# EAGLE design motherboard (EAGLE 9.0.0)

## Sheet 1 of 6: Power
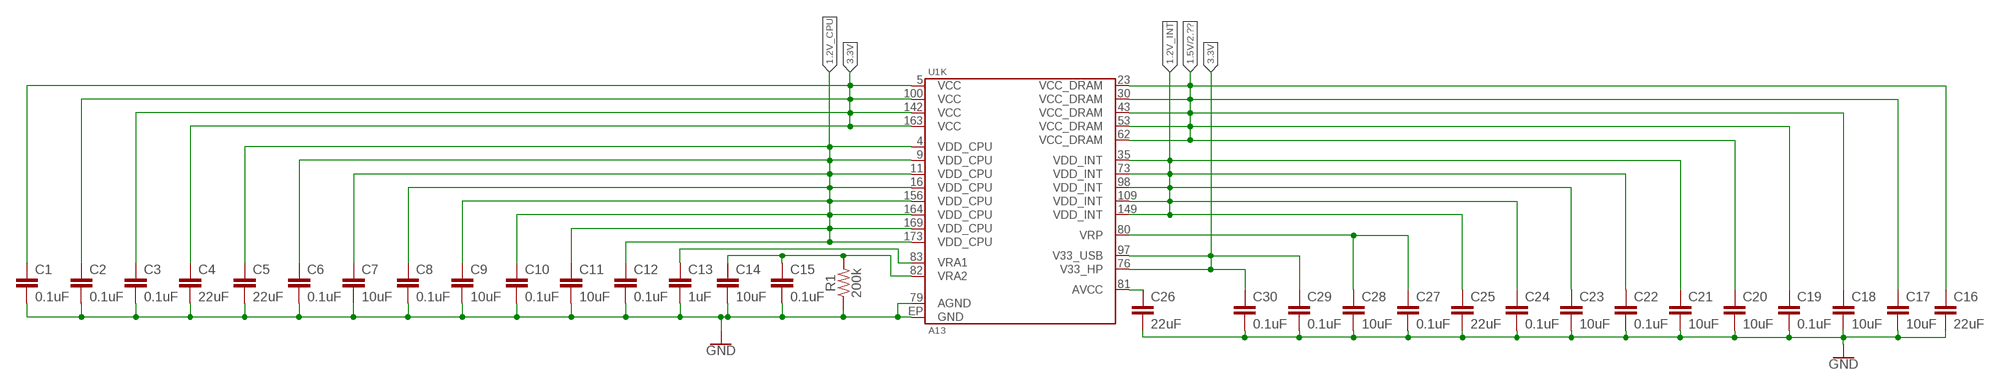
[diagram p0: schematic, sheet 1]

### Parts
C1  0.1uF  0.1UF-0603-25V-(+80/-20%)  [0603]
C2  0.1uF  0.1UF-0603-25V-(+80/-20%)  [0603]
C3  0.1uF  0.1UF-0603-25V-(+80/-20%)  [0603]
C4  22uF  0.1UF-0603-25V-(+80/-20%)  [0603]
C5  22uF  0.1UF-0603-25V-(+80/-20%)  [0603]
C6  0.1uF  0.1UF-0603-25V-(+80/-20%)  [0603]
C7  10uF  0.1UF-0603-25V-(+80/-20%)  [0603]
C8  0.1uF  0.1UF-0603-25V-(+80/-20%)  [0603]
C9  10uF  0.1UF-0603-25V-(+80/-20%)  [0603]
C10  0.1uF  0.1UF-0603-25V-(+80/-20%)  [0603]
C11  10uF  0.1UF-0603-25V-(+80/-20%)  [0603]
C12  0.1uF  0.1UF-0603-25V-(+80/-20%)  [0603]
C13  1uF  0.1UF-0603-25V-(+80/-20%)  [0603]
C14  10uF  0.1UF-0603-25V-(+80/-20%)  [0603]
C15  0.1uF  0.1UF-0603-25V-(+80/-20%)  [0603]
C16  22uF  0.1UF-0603-25V-(+80/-20%)  [0603]
C17  10uF  0.1UF-0603-25V-(+80/-20%)  [0603]
C18  10uF  0.1UF-0603-25V-(+80/-20%)  [0603]
C19  0.1uF  0.1UF-0603-25V-(+80/-20%)  [0603]
C20  10uF  0.1UF-0603-25V-(+80/-20%)  [0603]
C21  10uF  0.1UF-0603-25V-(+80/-20%)  [0603]
C22  0.1uF  0.1UF-0603-25V-(+80/-20%)  [0603]
C23  10uF  0.1UF-0603-25V-(+80/-20%)  [0603]
C24  0.1uF  0.1UF-0603-25V-(+80/-20%)  [0603]
C25  22uF  0.1UF-0603-25V-(+80/-20%)  [0603]
C26  22uF  0.1UF-0603-25V-(+80/-20%)  [0603]
C27  0.1uF  0.1UF-0603-25V-(+80/-20%)  [0603]
C28  10uF  0.1UF-0603-25V-(+80/-20%)  [0603]
C29  0.1uF  0.1UF-0603-25V-(+80/-20%)  [0603]
C30  0.1uF  0.1UF-0603-25V-(+80/-20%)  [0603]
R1  200k  200KOHM-0603-1/10W-1%  [0603]
U1  A13  [A13]

### Nets
1.2V_CPU: C5.1 C6.1 C7.1 C8.1 C9.1 C10.1 C11.1 C12.1 U1.4(K:VDD_CPU) U1.9(K:VDD_CPU) U1.11(K:VDD_CPU) U1.16(K:VDD_CPU) U1.156(K:VDD_CPU) U1.164(K:VDD_CPU) U1.169(K:VDD_CPU) U1.173(K:VDD_CPU)
1.2V_INT: C21.1 C22.1 C23.1 C24.1 C25.1 U1.35(K:VDD_INT) U1.73(K:VDD_INT) U1.98(K:VDD_INT) U1.109(K:VDD_INT) U1.149(K:VDD_INT)
1.5V: C16.1 C17.1 C18.1 C19.1 C20.1 U1.23(K:VCC_DRAM) U1.30(K:VCC_DRAM) U1.43(K:VCC_DRAM) U1.53(K:VCC_DRAM) U1.62(K:VCC_DRAM) ; also sheet 2
3.3V: C1.1 C2.1 C3.1 C4.1 C29.1 C30.1 U1.5(K:VCC) U1.76(K:V33_HP) U1.97(K:V33_USB) U1.100(K:VCC) U1.142(K:VCC) U1.163(K:VCC)
GND: C1.2 C2.2 C3.2 C4.2 C5.2 C6.2 C7.2 C8.2 C9.2 C10.2 C11.2 C12.2 C13.2 C14.2 C15.2 C16.2 C17.2 C18.2 C19.2 C20.2 C21.2 C22.2 C23.2 C24.2 C25.2 C26.2 C27.2 C28.2 C29.2 C30.2 R1.1 U1.79(K:AGND) U1.EP(K:GND) ; also sheet 2,6
N$12: C13.1 U1.83(K:VRA1)
N$13: C14.1 C15.1 R1.2 U1.82(K:VRA2)
N$24: C26.1 U1.81(K:AVCC)
N$25: C27.1 C28.1 U1.80(K:VRP)
Unconnected: U1.74(B:HPOUTL) U1.75(B:HPBP) U1.77(B:HPCOM) U1.78(B:HPOUTR) U1.84(B:MIC_IN1) U1.85(B:V_MIC) U1.126(H:LCD_VSYNC) U1.127(H:LCD_HSYNC) U1.128(H:LCD_DE) U1.129(H:LCD_CLK) U1.130(H:LCD_D23) U1.131(H:LCD_D22) U1.132(H:LCD_D21) U1.133(H:LCD_D20) U1.134(H:LCD_D19) U1.135(H:LCD_D18) U1.136(H:LCD_D15) U1.137(H:LCD_D14) U1.138(H:LCD_D13) U1.139(H:LCD_D12) U1.140(H:LCD_D11) U1.141(H:LCD_D10) U1.143(H:LCD_D7) U1.144(H:LCD_D6) U1.145(H:LCD_D5) U1.146(H:LCD_D4) U1.147(H:LCD_D3) U1.148(H:LCD_D2)

## Sheet 2 of 6: DRAM
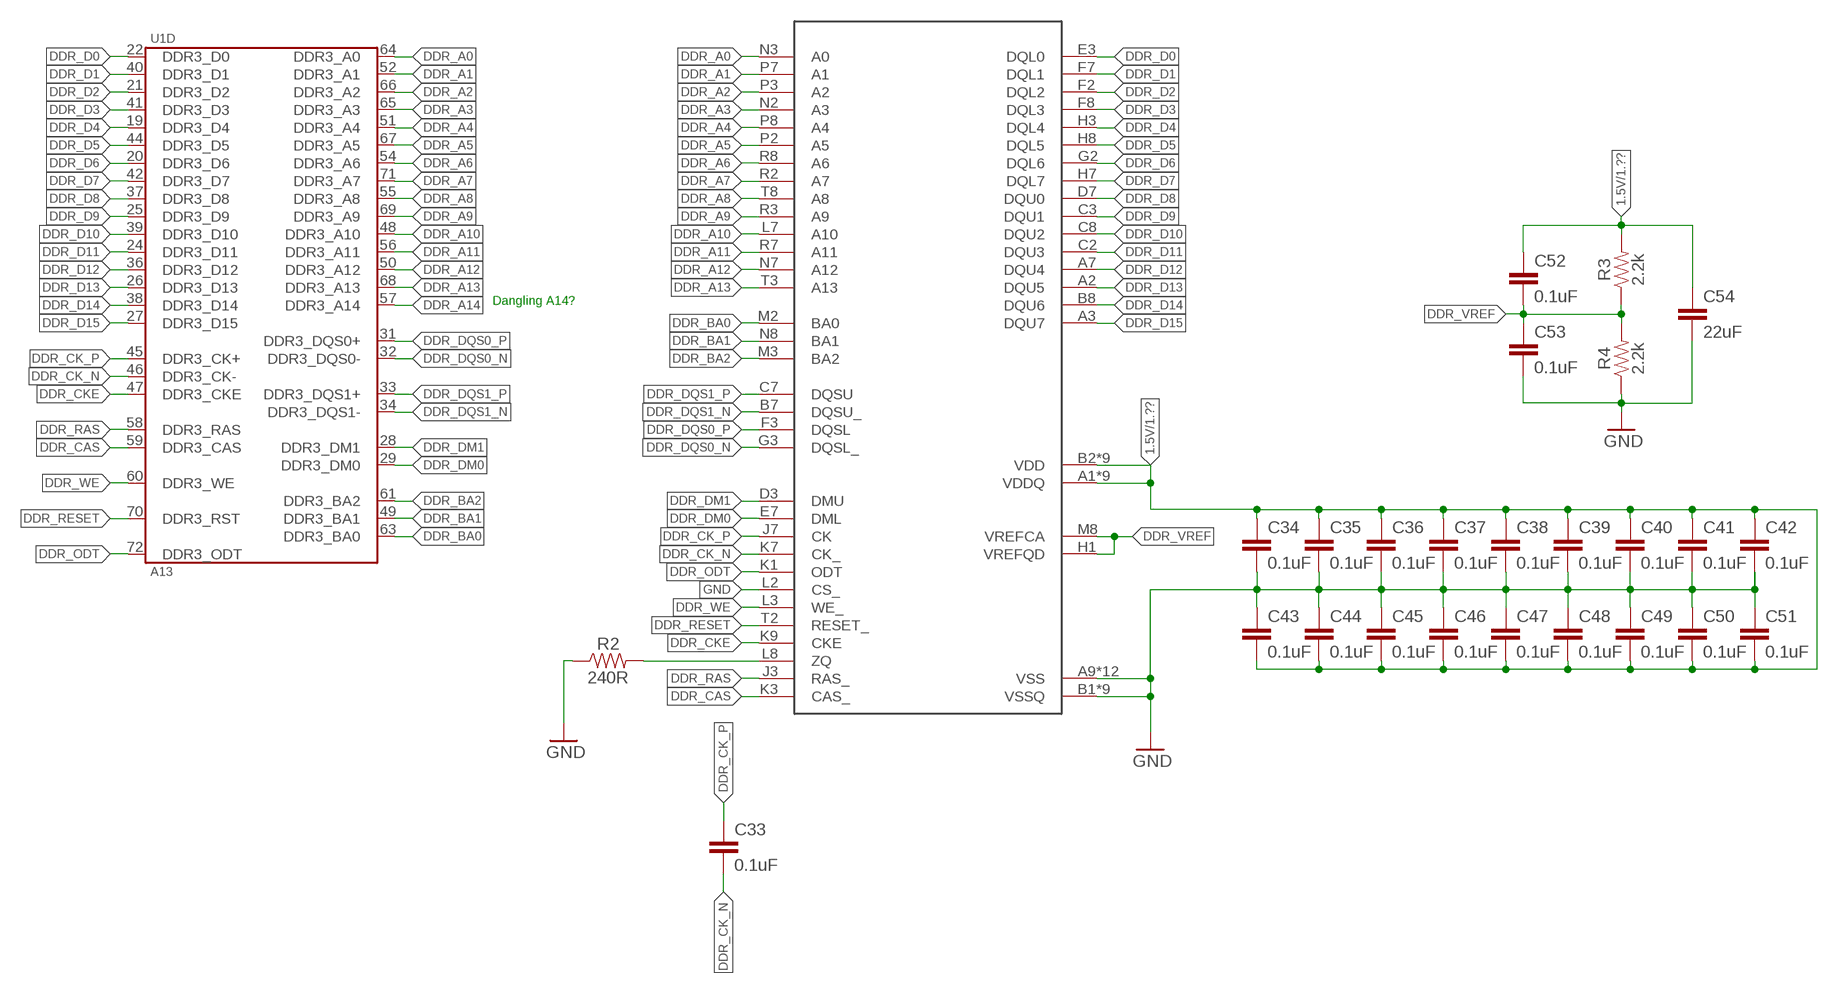
[diagram p1: schematic, sheet 2]

### Parts
C33  0.1uF  0.1UF-0603-25V-(+80/-20%)  [0603]
C34  0.1uF  0.1UF-0603-25V-(+80/-20%)  [0603]
C35  0.1uF  0.1UF-0603-25V-(+80/-20%)  [0603]
C36  0.1uF  0.1UF-0603-25V-(+80/-20%)  [0603]
C37  0.1uF  0.1UF-0603-25V-(+80/-20%)  [0603]
C38  0.1uF  0.1UF-0603-25V-(+80/-20%)  [0603]
C39  0.1uF  0.1UF-0603-25V-(+80/-20%)  [0603]
C40  0.1uF  0.1UF-0603-25V-(+80/-20%)  [0603]
C41  0.1uF  0.1UF-0603-25V-(+80/-20%)  [0603]
C42  0.1uF  0.1UF-0603-25V-(+80/-20%)  [0603]
C43  0.1uF  0.1UF-0603-25V-(+80/-20%)  [0603]
C44  0.1uF  0.1UF-0603-25V-(+80/-20%)  [0603]
C45  0.1uF  0.1UF-0603-25V-(+80/-20%)  [0603]
C46  0.1uF  0.1UF-0603-25V-(+80/-20%)  [0603]
C47  0.1uF  0.1UF-0603-25V-(+80/-20%)  [0603]
C48  0.1uF  0.1UF-0603-25V-(+80/-20%)  [0603]
C49  0.1uF  0.1UF-0603-25V-(+80/-20%)  [0603]
C50  0.1uF  0.1UF-0603-25V-(+80/-20%)  [0603]
C51  0.1uF  0.1UF-0603-25V-(+80/-20%)  [0603]
C52  0.1uF  0.1UF-0603-25V-(+80/-20%)  [0603]
C53  0.1uF  0.1UF-0603-25V-(+80/-20%)  [0603]
C54  22uF  0.1UF-0603-25V-(+80/-20%)  [0603]
DRAM  AS4C128M16D3B-12BCN  [FBGA96-6X16]
R2  240R  200KOHM-0603-1/10W-1%  [0603]
R3  2.2k  200KOHM-0603-1/10W-1%  [0603]
R4  2.2k  200KOHM-0603-1/10W-1%  [0603]

### Nets
1.5V: C34.1 C35.1 C36.1 C37.1 C38.1 C39.1 C40.1 C41.1 C42.1 C43.2 C44.2 C45.2 C46.2 C47.2 C48.2 C49.2 C50.2 C51.2 C52.1 C54.1 DRAM.A1(VDDQ) DRAM.A8(VDDQ) DRAM.B2(VDD) DRAM.C1(VDDQ) DRAM.C9(VDDQ) DRAM.D2(VDDQ) DRAM.D9(VDD) DRAM.E9(VDDQ) DRAM.F1(VDDQ) DRAM.G7(VDD) DRAM.H2(VDDQ) DRAM.H9(VDDQ) DRAM.K2(VDD) DRAM.K8(VDD) DRAM.N1(VDD) DRAM.N9(VDD) DRAM.R1(VDD) DRAM.R9(VDD) R3.2 ; also sheet 1
DDR_A0: DRAM.N3(A0) U1.64(D:DDR3_A0)
DDR_A1: DRAM.P7(A1) U1.52(D:DDR3_A1)
DDR_A2: DRAM.P3(A2) U1.66(D:DDR3_A2)
DDR_A3: DRAM.N2(A3) U1.65(D:DDR3_A3)
DDR_A4: DRAM.P8(A4) U1.51(D:DDR3_A4)
DDR_A5: DRAM.P2(A5) U1.67(D:DDR3_A5)
DDR_A6: DRAM.R8(A6) U1.54(D:DDR3_A6)
DDR_A7: DRAM.R2(A7) U1.71(D:DDR3_A7)
DDR_A8: DRAM.T8(A8) U1.55(D:DDR3_A8)
DDR_A9: DRAM.R3(A9) U1.69(D:DDR3_A9)
DDR_A10: DRAM.L7(A10) U1.48(D:DDR3_A10)
DDR_A11: DRAM.R7(A11) U1.56(D:DDR3_A11)
DDR_A12: DRAM.N7(A12) U1.50(D:DDR3_A12)
DDR_A13: DRAM.T3(A13) U1.68(D:DDR3_A13)
DDR_A14: U1.57(D:DDR3_A14)
DDR_BA0: DRAM.M2(BA0) U1.63(D:DDR3_BA0)
DDR_BA1: DRAM.N8(BA1) U1.49(D:DDR3_BA1)
DDR_BA2: DRAM.M3(BA2) U1.61(D:DDR3_BA2)
DDR_CAS: DRAM.K3(CAS_) U1.59(D:DDR3_CAS)
DDR_CK_N: C33.2 DRAM.K7(CK_) U1.46(D:DDR3_CK-)
DDR_CK_P: C33.1 DRAM.J7(CK) U1.45(D:DDR3_CK+)
DDR_CKE: DRAM.K9(CKE) U1.47(D:DDR3_CKE)
DDR_D0: DRAM.E3(DQL0) U1.22(D:DDR3_D0)
DDR_D1: DRAM.F7(DQL1) U1.40(D:DDR3_D1)
DDR_D2: DRAM.F2(DQL2) U1.21(D:DDR3_D2)
DDR_D3: DRAM.F8(DQL3) U1.41(D:DDR3_D3)
DDR_D4: DRAM.H3(DQL4) U1.19(D:DDR3_D4)
DDR_D5: DRAM.H8(DQL5) U1.44(D:DDR3_D5)
DDR_D6: DRAM.G2(DQL6) U1.20(D:DDR3_D6)
DDR_D7: DRAM.H7(DQL7) U1.42(D:DDR3_D7)
DDR_D8: DRAM.D7(DQU0) U1.37(D:DDR3_D8)
DDR_D9: DRAM.C3(DQU1) U1.25(D:DDR3_D9)
DDR_D10: DRAM.C8(DQU2) U1.39(D:DDR3_D10)
DDR_D11: DRAM.C2(DQU3) U1.24(D:DDR3_D11)
DDR_D12: DRAM.A7(DQU4) U1.36(D:DDR3_D12)
DDR_D13: DRAM.A2(DQU5) U1.26(D:DDR3_D13)
DDR_D14: DRAM.B8(DQU6) U1.38(D:DDR3_D14)
DDR_D15: DRAM.A3(DQU7) U1.27(D:DDR3_D15)
DDR_DM0: DRAM.E7(DML) U1.29(D:DDR3_DM0)
DDR_DM1: DRAM.D3(DMU) U1.28(D:DDR3_DM1)
DDR_DQS0_N: DRAM.G3(DQSL_) U1.32(D:DDR3_DQS0-)
DDR_DQS0_P: DRAM.F3(DQSL) U1.31(D:DDR3_DQS0+)
DDR_DQS1_N: DRAM.B7(DQSU_) U1.34(D:DDR3_DQS1-)
DDR_DQS1_P: DRAM.C7(DQSU) U1.33(D:DDR3_DQS1+)
DDR_ODT: DRAM.K1(ODT) U1.72(D:DDR3_ODT)
DDR_RAS: DRAM.J3(RAS_) U1.58(D:DDR3_RAS)
DDR_RESET: DRAM.T2(RESET_) U1.70(D:DDR3_RST)
DDR_VREF: C52.2 C53.1 DRAM.H1(VREFQD) DRAM.M8(VREFCA) R3.1 R4.2
DDR_WE: DRAM.L3(WE_) U1.60(D:DDR3_WE)
GND: C34.2 C35.2 C36.2 C37.2 C38.2 C39.2 C40.2 C41.2 C42.2 C43.1 C44.1 C45.1 C46.1 C47.1 C48.1 C49.1 C50.1 C51.1 C53.2 C54.2 DRAM.A9(VSS) DRAM.B1(VSSQ) DRAM.B3(VSS) DRAM.B9(VSSQ) DRAM.D1(VSSQ) DRAM.D8(VSSQ) DRAM.E1(VSS) DRAM.E2(VSSQ) DRAM.E8(VSSQ) DRAM.F9(VSSQ) DRAM.G1(VSSQ) DRAM.G8(VSS) DRAM.G9(VSSQ) DRAM.J2(VSS) DRAM.J8(VSS) DRAM.L2(CS_) DRAM.M1(VSS) DRAM.M9(VSS) DRAM.P1(VSS) DRAM.P9(VSS) DRAM.T1(VSS) DRAM.T9(VSS) R2.1 R4.1 ; also sheet 1,6
ZQ: DRAM.L8(ZQ) R2.2

### Notes on the sheet
- Dangling A14?

## Sheet 3 of 6: IO

## Sheet 4 of 6: Storage

## Sheet 5 of 6: Other parts
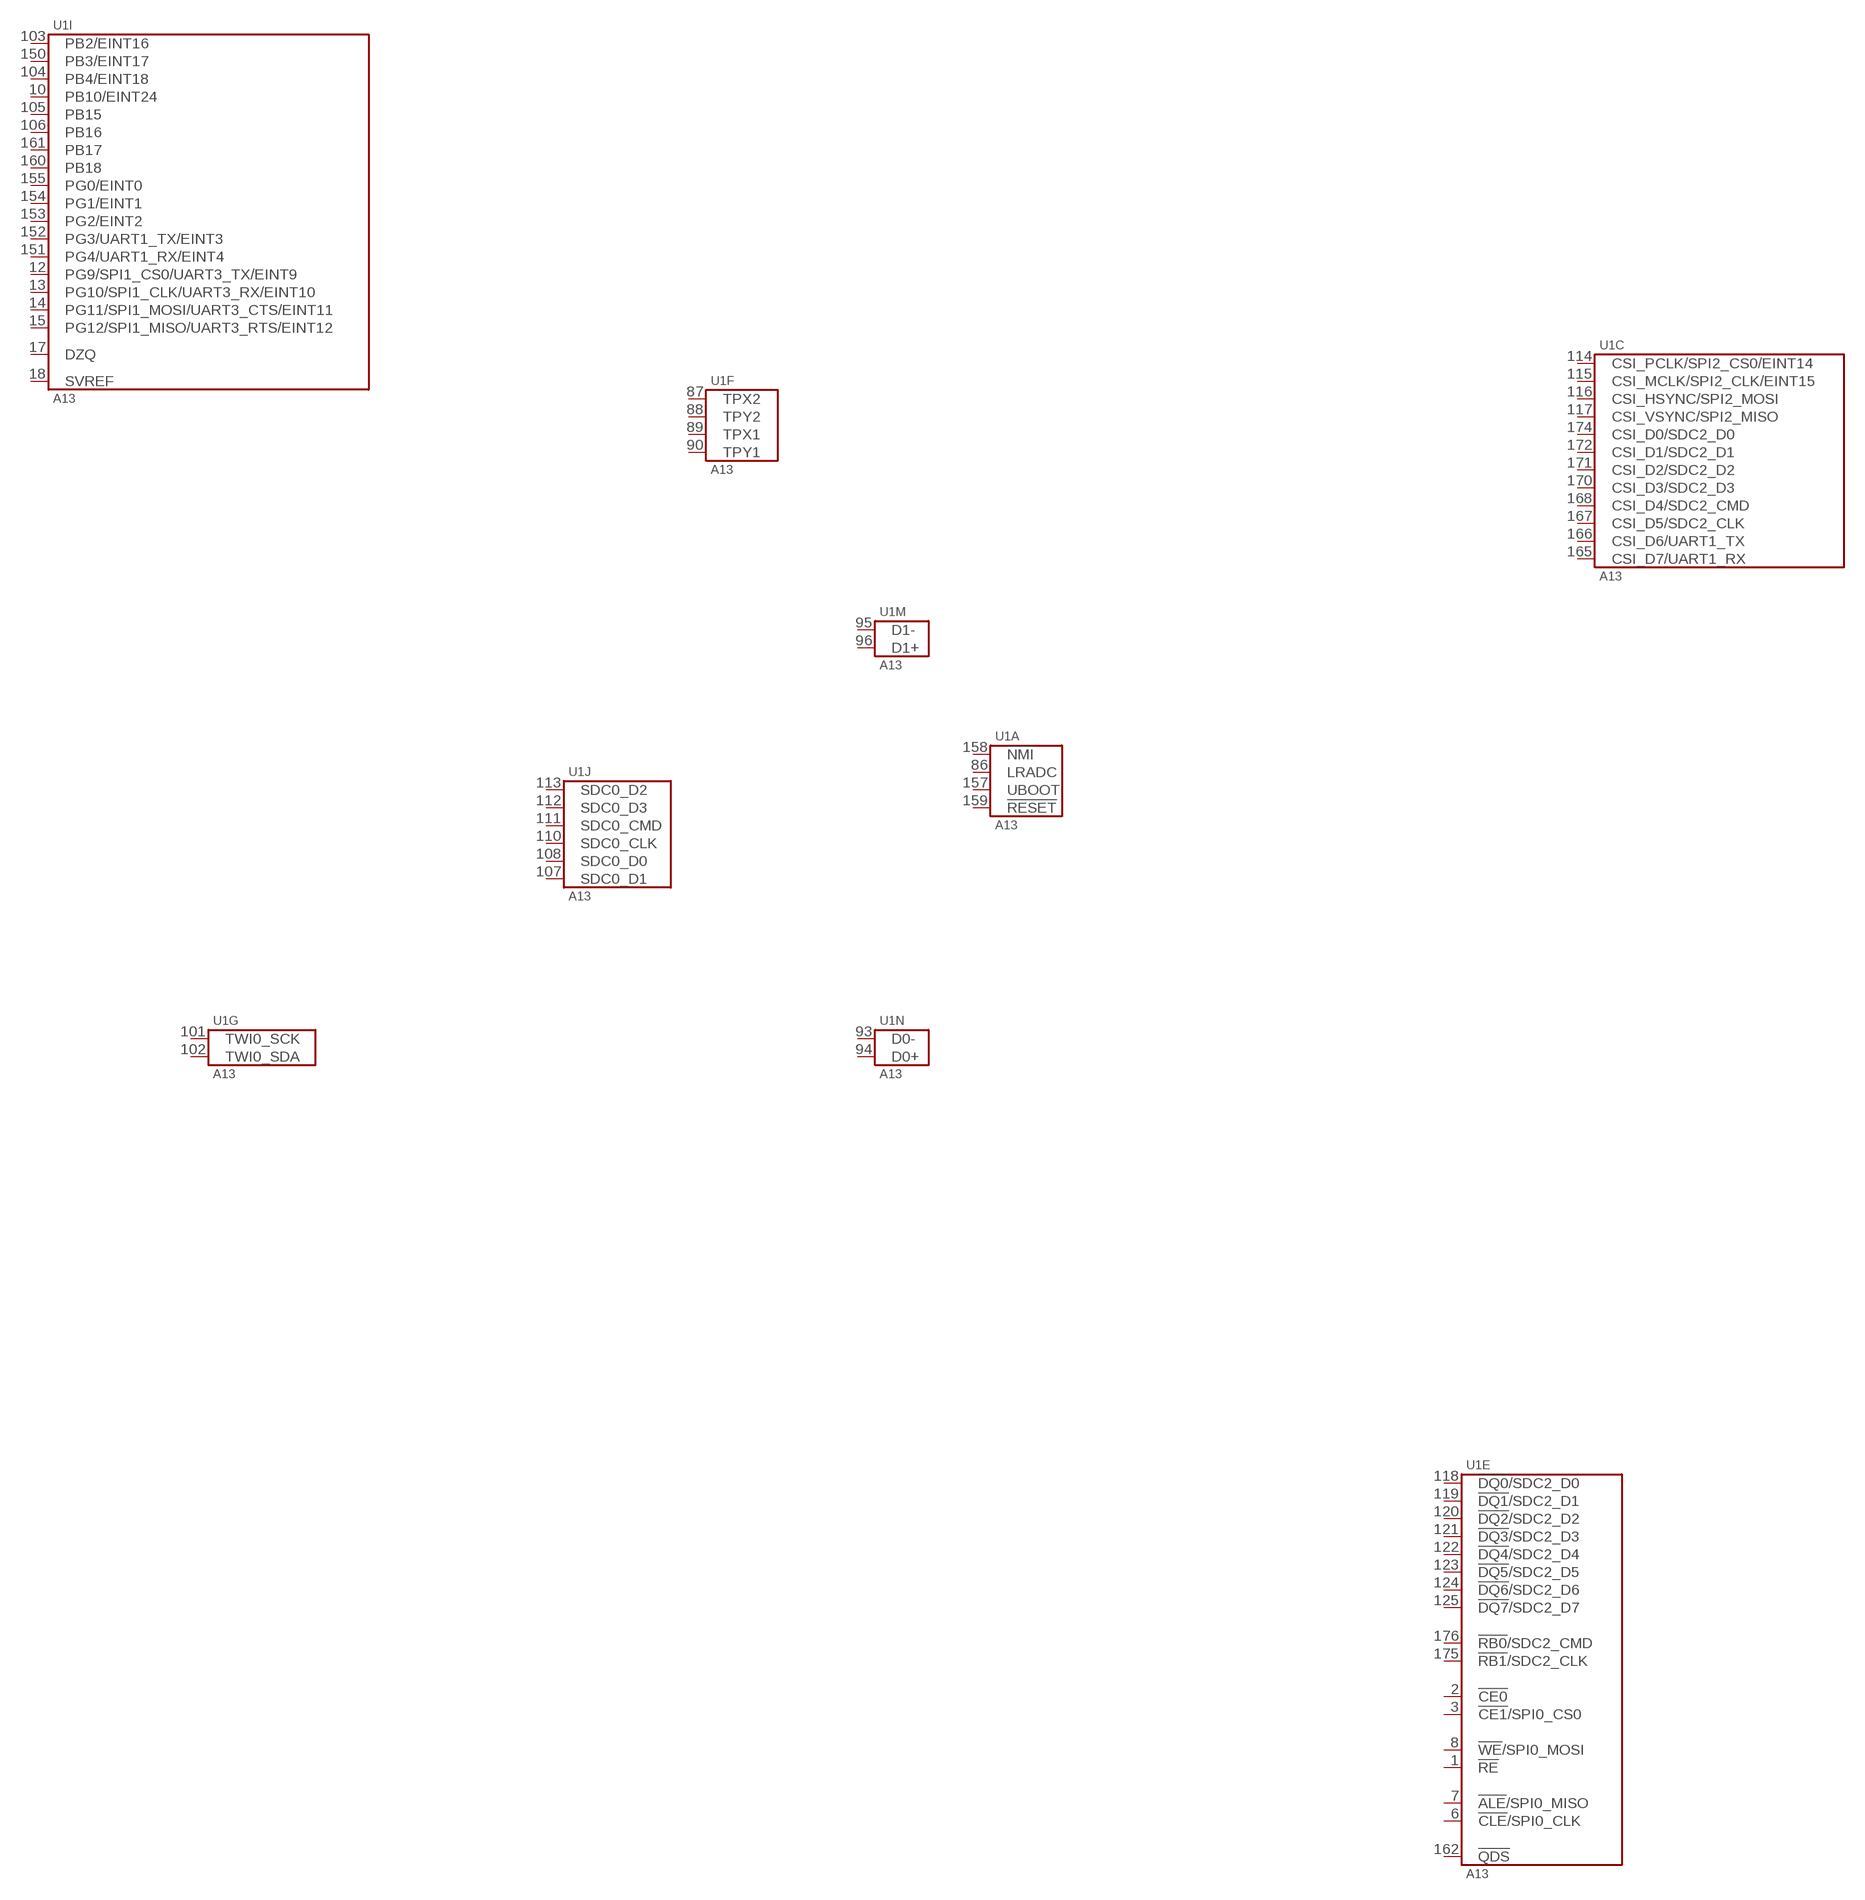
[diagram p2: schematic, sheet 5]
Unconnected: U1.1(E:!RE) U1.2(E:!CE0) U1.3(E:!CE1!/SPI0_CS0) U1.6(E:!CLE!/SPI0_CLK) U1.7(E:!ALE!/SPI0_MISO) U1.8(E:!WE!/SPI0_MOSI) U1.10(I:PB10/EINT24) U1.12(I:PG9/SPI1_CS0/UART3_TX/EINT9) U1.13(I:PG10/SPI1_CLK/UART3_RX/EINT10) U1.14(I:PG11/SPI1_MOSI/UART3_CTS/EINT11) U1.15(I:PG12/SPI1_MISO/UART3_RTS/EINT12) U1.17(I:DZQ) U1.18(I:SVREF) U1.86(A:LRADC) U1.87(F:TPX2) U1.88(F:TPY2) U1.89(F:TPX1) U1.90(F:TPY1) U1.93(N:D0-) U1.94(N:D0+) U1.95(M:D1-) U1.96(M:D1+) U1.101(G:TWI0_SCK) U1.102(G:TWI0_SDA) U1.103(I:PB2/EINT16) U1.104(I:PB4/EINT18) U1.105(I:PB15) U1.106(I:PB16) U1.107(J:SDC0_D1) U1.108(J:SDC0_D0) U1.110(J:SDC0_CLK) U1.111(J:SDC0_CMD) U1.112(J:SDC0_D3) U1.113(J:SDC0_D2) U1.114(C:CSI_PCLK/SPI2_CS0/EINT14) U1.115(C:CSI_MCLK/SPI2_CLK/EINT15) U1.116(C:CSI_HSYNC/SPI2_MOSI) U1.117(C:CSI_VSYNC/SPI2_MISO) U1.118(E:!DQ0!/SDC2_D0) U1.119(E:!DQ1!/SDC2_D1) U1.120(E:!DQ2!/SDC2_D2) U1.121(E:!DQ3!/SDC2_D3) U1.122(E:!DQ4!/SDC2_D4) U1.123(E:!DQ5!/SDC2_D5) U1.124(E:!DQ6!/SDC2_D6) U1.125(E:!DQ7!/SDC2_D7) U1.150(I:PB3/EINT17) U1.151(I:PG4/UART1_RX/EINT4) U1.152(I:PG3/UART1_TX/EINT3) U1.153(I:PG2/EINT2) U1.154(I:PG1/EINT1) U1.155(I:PG0/EINT0) U1.157(A:UBOOT) U1.158(A:!NMI) U1.159(A:!RESET) U1.160(I:PB18) U1.161(I:PB17) U1.162(E:!QDS) U1.165(C:CSI_D7/UART1_RX) U1.166(C:CSI_D6/UART1_TX) U1.167(C:CSI_D5/SDC2_CLK) U1.168(C:CSI_D4/SDC2_CMD) U1.170(C:CSI_D3/SDC2_D3) U1.171(C:CSI_D2/SDC2_D2) U1.172(C:CSI_D1/SDC2_D1) U1.174(C:CSI_D0/SDC2_D0) U1.175(E:!RB1!/SDC2_CLK) U1.176(E:!RB0!/SDC2_CMD)

## Sheet 6 of 6: Timing
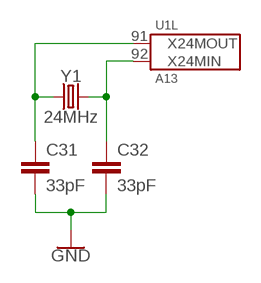
[diagram p3: schematic, sheet 6]

### Parts
C31  33pF  0.1UF-0603-25V-(+80/-20%)  [0603]
C32  33pF  0.1UF-0603-25V-(+80/-20%)  [0603]
Y1  24MHz  CRYSTAL-24MHZ"  [CRYSTAL-SMD-5X3.2-4PAD]

### Nets
GND: C31.2 C32.2 ; also sheet 1,2
N$1: C32.1 U1.92(L:X24MIN) Y1.3
N$2: C31.1 U1.91(L:X24MOUT) Y1.1

## Library data of the parts
C1-C3 C6 C8 C10 C12 C15 C19 C22 C24 C27 C29 C30 C33-C53 = SparkFun-Capacitors:0.1UF: 0.1µF ceramic capacitors A capacitor is a passive two-terminal electrical component used to store electrical energy temporarily in an electric field.; PROD_ID: CAP-00810
C4 C5 C7 C9 C11 C13 C14 C16-C18 C20 C21 C23 C25 C26 C28 C31 C32 C54 = SparkFun-Capacitors:0.1UF: 0.1µF ceramic capacitors A capacitor is a passive two-terminal electrical component used to store electrical energy temporarily in an electric field.; PROD_ID: CAP-00810; VALUE: 0.1uF
DRAM = custom:AS4C128M16D3B-12BCN
R1 = SparkFun-Resistors:200KOHM: 200kΩ resistor A resistor is a passive two-terminal electrical component that implements electrical resistance as a circuit element. Resistors act to reduce current flow, and, at the same time, act to lower voltage levels within circuits. - Wikipedia; PROD_ID: RES-09385
R2-R4 = SparkFun-Resistors:200KOHM: 200kΩ resistor A resistor is a passive two-terminal electrical component that implements electrical resistance as a circuit element. Resistors act to reduce current flow, and, at the same time, act to lower voltage levels within circuits. - Wikipedia; PROD_ID: RES-09385; VALUE: 200k
U1 = Allwinner:A13
Y1 = SparkFun-Clocks:CRYSTAL-24MHZ: 24MHz Crystal Datasheet <http://www.sparkfun.com/datasheets/Components/AT-SMD-5x3.pdf> Frequency: 24MHz Frequency Tolerance: ±20ppm Load Capacitance: 12pF SparkFun Products: USB Bit Whacker <https://www.sparkfun.com/products/762>; PROD_ID: XTAL-08298; SF_ID: COM-08581

## Board
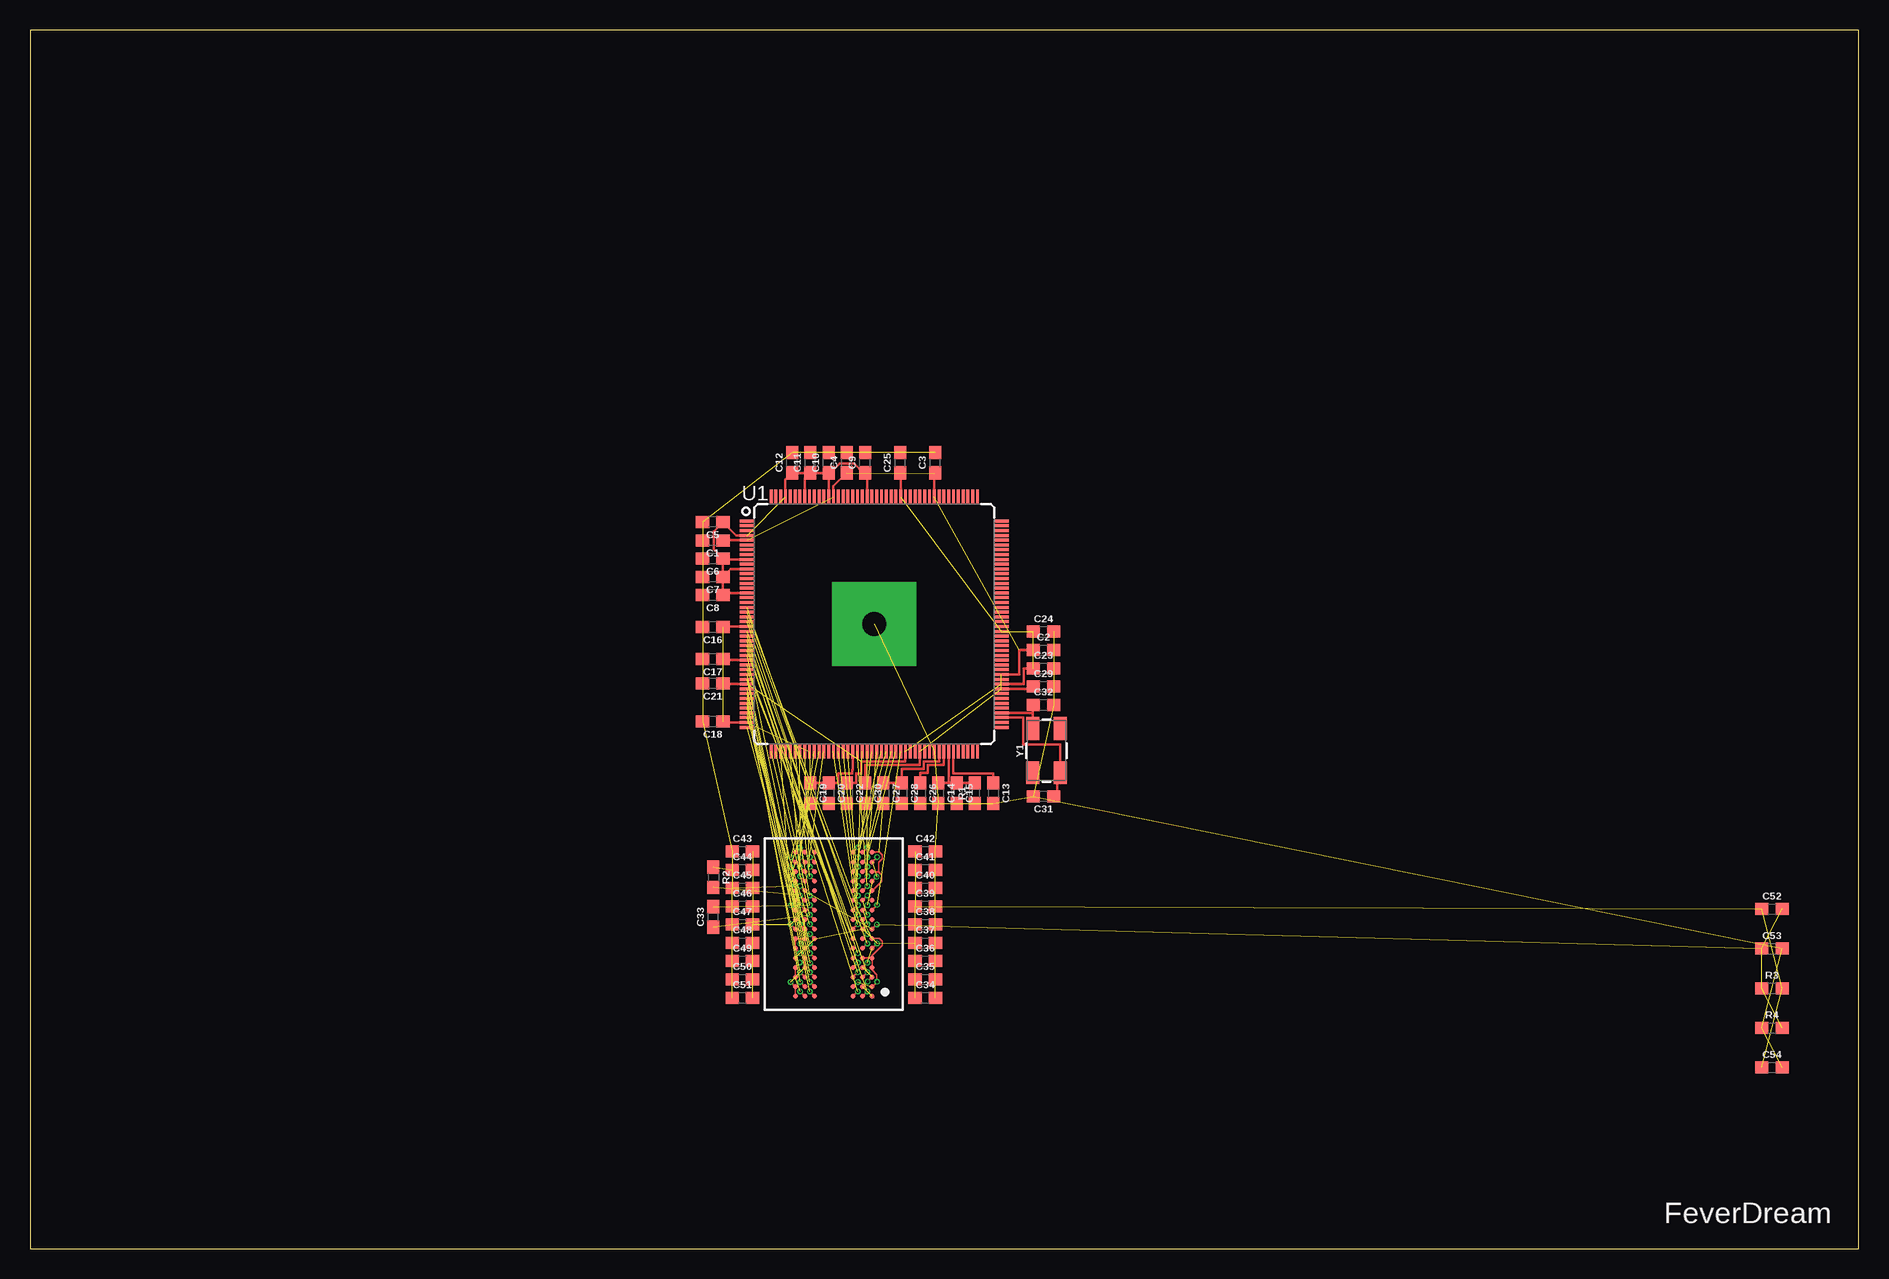
[diagram p4: board, top side]

Size 152.4 x 101.6 mm. Coordinates in mm from the lower left corner, seen from the top.
Outline: 0,0 152.4,0 152.4,101.6 0,101.6 0,0
Copper layers (1*2*15*16): Top 0.035559375mm / dielectric 0.17018125mm / Route2 0.01778125mm / dielectric 47mil / Route15 0.01778125mm / dielectric 0.17018125mm / Bottom 0.035559375mm
Design rules "oshpark-4layer": minimum track width 5mil, minimum drill 10mil, track to track 5mil, track to pad 5mil, pad to pad 5mil, via to via 5mil, smd to smd 0mil, copper to edge 5mil, drill to drill 10mil, minimum pad ring 4mil, minimum via ring 4mil, stop-mask expansion 2mil, vias tented up to drill 25mil, thermal gap 10mil

### Footprints (pad centres in the part's own frame; a part is rotated, then mirrored left to right if it is on the bottom)
0603 = smd 1.1 x 1: 1 -0.85,0; 2 0.85,0
FBGA96-6X16 = smd 0.42 x 0.42: A1 -3.2,5.6; A2 -2.4,5.6; A3 -1.6,5.6; A7 1.6,5.6; A8 2.4,5.6; A9 3.2,5.6; B1 -3.2,4.8; B2 -2.4,4.8; B3 -1.6,4.8; B7 1.6,4.8; B8 2.4,4.8; B9 3.2,4.8; C1 -3.2,4; C2 -2.4,4; C3 -1.6,4; C7 1.6,4; C8 2.4,4; C9 3.2,4; D1 -3.2,3.2; D2 -2.4,3.2; D3 -1.6,3.2; D7 1.6,3.2; D8 2.4,3.2; D9 3.2,3.2; E1 -3.2,2.4; E2 -2.4,2.4; E3 -1.6,2.4; E7 1.6,2.4; E8 2.4,2.4; E9 3.2,2.4; F1 -3.2,1.6; F2 -2.4,1.6; F3 -1.6,1.6; F7 1.6,1.6; F8 2.4,1.6; F9 3.2,1.6; G1 -3.2,0.8; G2 -2.4,0.8; G3 -1.6,0.8; G7 1.6,0.8; G8 2.4,0.8; G9 3.2,0.8; H1 -3.2,0; H2 -2.4,0; H3 -1.6,0; H7 1.6,0; H8 2.4,0; H9 3.2,0; J1 -3.2,-0.8; J2 -2.4,-0.8; J3 -1.6,-0.8; J7 1.6,-0.8; J8 2.4,-0.8; J9 3.2,-0.8; K1 -3.2,-1.6; K2 -2.4,-1.6; K3 -1.6,-1.6; K7 1.6,-1.6; K8 2.4,-1.6; K9 3.2,-1.6; L1 -3.2,-2.4; L2 -2.4,-2.4; L3 -1.6,-2.4; L7 1.6,-2.4; L8 2.4,-2.4; L9 3.2,-2.4; M1 -3.2,-3.2; M2 -2.4,-3.2; M3 -1.6,-3.2; M7 1.6,-3.2; M8 2.4,-3.2; M9 3.2,-3.2; N1 -3.2,-4; N2 -2.4,-4; N3 -1.6,-4; N7 1.6,-4; N8 2.4,-4; N9 3.2,-4; P1 -3.2,-4.8; P2 -2.4,-4.8; P3 -1.6,-4.8; P7 1.6,-4.8; P8 2.4,-4.8; P9 3.2,-4.8; R1 -3.2,-5.6; R2 -2.4,-5.6; R3 -1.6,-5.6; R7 1.6,-5.6; R8 2.4,-5.6; R9 3.2,-5.6; T1 -3.2,-6.4; T2 -2.4,-6.4; T3 -1.6,-6.4; T7 1.6,-6.4; T8 2.4,-6.4; T9 3.2,-6.4
A13 = smd 1.2 x 0.245: 1 -10.6,8.6; 2 -10.6,8.2; 3 -10.6,7.8; 4 -10.6,7.4; 5 -10.6,7; 6 -10.6,6.6; 7 -10.6,6.2; 8 -10.6,5.8; 9 -10.6,5.4; 10 -10.6,5; 11 -10.6,4.6; 12 -10.6,4.2; 13 -10.6,3.8; 14 -10.6,3.4; 15 -10.6,3; 16 -10.6,2.6; 17 -10.6,2.2; 18 -10.6,1.8; 19 -10.6,1.4; 20 -10.6,1; 21 -10.6,0.6; 22 -10.6,0.2; 23 -10.6,-0.2; 24 -10.6,-0.6; 25 -10.6,-1; 26 -10.6,-1.4; 27 -10.6,-1.8; 28 -10.6,-2.2; 29 -10.6,-2.6; 30 -10.6,-3; 31 -10.6,-3.4; 32 -10.6,-3.8; 33 -10.6,-4.2; 34 -10.6,-4.6; 35 -10.6,-5; 36 -10.6,-5.4; 37 -10.6,-5.8; 38 -10.6,-6.2; 39 -10.6,-6.6; 40 -10.6,-7; 41 -10.6,-7.4; 42 -10.6,-7.8; 43 -10.6,-8.2; 44 -10.6,-8.6; 89 10.6,-8.6; 90 10.6,-8.2; 91 10.6,-7.8; 92 10.6,-7.4; 93 10.6,-7; 94 10.6,-6.6; 95 10.6,-6.2; 96 10.6,-5.8; 97 10.6,-5.4; 98 10.6,-5; 99 10.6,-4.6; 100 10.6,-4.2; 101 10.6,-3.8; 102 10.6,-3.4; 103 10.6,-3; 104 10.6,-2.6; 105 10.6,-2.2; 106 10.6,-1.8; 107 10.6,-1.4; 108 10.6,-1; 109 10.6,-0.6; 110 10.6,-0.2; 111 10.6,0.2; 112 10.6,0.6; 113 10.6,1; 114 10.6,1.4; 115 10.6,1.8; 116 10.6,2.2; 117 10.6,2.6; 118 10.6,3; 119 10.6,3.4; 120 10.6,3.8; 121 10.6,4.2; 122 10.6,4.6; 123 10.6,5; 124 10.6,5.4; 125 10.6,5.8; 126 10.6,6.2; 127 10.6,6.6; 128 10.6,7; 129 10.6,7.4; 130 10.6,7.8; 131 10.6,8.2; 132 10.6,8.6 | smd 0.245 x 1.2: 45 -8.6,-10.6; 46 -8.2,-10.6; 47 -7.8,-10.6; 48 -7.4,-10.6; 49 -7,-10.6; 50 -6.6,-10.6; 51 -6.2,-10.6; 52 -5.8,-10.6; 53 -5.4,-10.6; 54 -5,-10.6; 55 -4.6,-10.6; 56 -4.2,-10.6; 57 -3.8,-10.6; 58 -3.4,-10.6; 59 -3,-10.6; 60 -2.6,-10.6; 61 -2.2,-10.6; 62 -1.8,-10.6; 63 -1.4,-10.6; 64 -1,-10.6; 65 -0.6,-10.6; 66 -0.2,-10.6; 67 0.2,-10.6; 68 0.6,-10.6; 69 1,-10.6; 70 1.4,-10.6; 71 1.8,-10.6; 72 2.2,-10.6; 73 2.6,-10.6; 74 3,-10.6; 75 3.4,-10.6; 76 3.8,-10.6; 77 4.2,-10.6; 78 4.6,-10.6; 79 5,-10.6; 80 5.4,-10.6; 81 5.8,-10.6; 82 6.2,-10.6; 83 6.6,-10.6; 84 7,-10.6; 85 7.4,-10.6; 86 7.8,-10.6; 87 8.2,-10.6; 88 8.6,-10.6; 133 8.6,10.6; 134 8.2,10.6; 135 7.8,10.6; 136 7.4,10.6; 137 7,10.6; 138 6.6,10.6; 139 6.2,10.6; 140 5.8,10.6; 141 5.4,10.6; 142 5,10.6; 143 4.6,10.6; 144 4.2,10.6; 145 3.8,10.6; 146 3.4,10.6; 147 3,10.6; 148 2.6,10.6; 149 2.2,10.6; 150 1.8,10.6; 151 1.4,10.6; 152 1,10.6; 153 0.6,10.6; 154 0.2,10.6; 155 -0.2,10.6; 156 -0.6,10.6; 157 -1,10.6; 158 -1.4,10.6; 159 -1.8,10.6; 160 -2.2,10.6; 161 -2.6,10.6; 162 -3,10.6; 163 -3.4,10.6; 164 -3.8,10.6; 165 -4.2,10.6; 166 -4.6,10.6; 167 -5,10.6; 168 -5.4,10.6; 169 -5.8,10.6; 170 -6.2,10.6; 171 -6.6,10.6; 172 -7,10.6; 173 -7.4,10.6; 174 -7.8,10.6; 175 -8.2,10.6; 176 -8.6,10.6 | drill 2 pad 7 square: EP 0,0
CRYSTAL-SMD-5X3.2-4PAD = smd 1.9 x 1.1: 1 -1.85,-1.15; 2 1.85,-1.15; 3 1.85,1.15; 4 -1.85,1.15

### Placement (x,y rotation side)
C1  56.9,59.05 180 top
C2  84.45,49.91 0 top
C3  75.44,65.53 90 top
C4  68.07,65.53 90 top
C5  56.9,60.58 180 top
C6  56.9,57.53 180 top
C7  56.9,56.01 180 top
C8  56.9,54.48 180 top
C9  69.6,65.53 90 top
C10  66.55,65.53 90 top
C11  65.02,65.53 90 top
C12  63.5,65.53 90 top
C13  80.26,37.97 270 top
C14  75.69,37.97 270 top
C15  77.22,37.97 270 top
C16  56.9,51.82 180 top
C17  56.9,49.15 180 top
C18  56.9,43.94 180 top
C19  65.02,37.97 270 top
C20  66.55,37.97 270 top
C21  56.9,47.12 180 top
C22  68.07,37.97 270 top
C23  84.45,48.39 0 top
C24  84.45,51.44 0 top
C25  72.52,65.53 90 top
C26  74.17,37.97 270 top
C27  71.12,37.97 270 top
C28  72.64,37.97 270 top
C29  84.45,46.86 0 top
C30  69.6,37.97 270 top
C31  84.45,37.72 180 top
C32  84.45,45.34 0 top
C33  56.95,27.66 90 top
C34  74.6,20.93 0 top
C35  74.6,22.45 0 top
C36  74.6,23.98 0 top
C37  74.6,25.5 0 top
C38  74.6,27.02 0 top
C39  74.6,28.55 0 top
C40  74.6,30.07 0 top
C41  74.6,31.6 0 top
C42  74.6,33.12 0 top
C43  59.36,33.12 0 top
C44  59.36,31.6 0 top
C45  59.36,30.07 0 top
C46  59.36,28.55 0 top
C47  59.36,27.02 0 top
C48  59.36,25.5 0 top
C49  59.36,23.98 0 top
C50  59.36,22.45 0 top
C51  59.36,20.93 0 top
C52  145.16,28.32 0 top
C53  145.16,25.02 0 top
C54  145.16,15.11 0 top
DRAM  66.98,26.64 180 top
R1  78.74,37.97 90 top
R2  56.95,30.96 270 top
R3  145.16,21.72 0 top
R4  145.16,18.41 0 top
U1  70.36,52.07 0 top
Y1  84.71,41.53 90 top

### Tracks (layer width: path | path; a pad name or v marks a point on that pad's centre or on a via)
1.2V_CPU  (1 unrouted)
  Top 0.203: U1.16 57.75,54.67 C8.1 C7.1 | U1.9 57.81,57.47 C6.1 | U1.4 58.85,59.47 C5.1 56.97,59.8 56.97,58.31 C6.1 | C6.1 C7.1 | U1.173 62.96,64.14 C12.1 C11.1 | U1.169 64.56,64.22 C11.1 | U1.164 66.55,62.68 C10.1 | U1.156 69.76,64.52 C9.1 69.44,64.68 68.67,65.46 67.48,65.46 66.7,64.68 C10.1 | C10.1 C11.1 | U1.11 58.41,56.67 C7.1
1.2V_INT  (5 unrouted)
  Top 0.203: C23.1 82.8,48.39 82.8,47.07 U1.98 | U1.73 72.96,40.64 69.27,40.64 69.27,39.6 68.87,39.6 68.87,38.82 C22.1 | C21.1 57.75,47.07 U1.35 | U1.149 72.56,64.64 C25.1
1.5V  (via drill 0.25 pad 0.36)  (40 unrouted)
  Top 0.102: DRAM.A1 70.3,20.93
  Top 0.127: DRAM.D2 v69.78,23.84 | v69.78,23.84 | DRAM.B2 v69.81,22.27 | v69.81,22.27 | DRAM.C1 | DRAM.C1 v69.81,22.27 | DRAM.H2 v69.78,27.04 | v69.78,27.04 | DRAM.K2 v69.78,28.64 | v69.78,28.64 | DRAM.F1 v70.59,25.45 | v70.59,25.45 | DRAM.N1 v70.54,31 | v70.54,31 | DRAM.R1 v70.59,32.66 | v70.59,32.66 | DRAM.A8 v64.18,21.44 | v64.18,21.44 | v64.16,23.86 64.16,23.82 DRAM.D9 63.78,23.24 63.76,23.22 63.76,22.87 63.78,22.85 DRAM.C9 | v64.16,23.86 | DRAM.E9 v64.16,23.86 | DRAM.G7 v64.98,26.24 | DRAM.R9 v63.41,32.62 | v63.41,32.62 | DRAM.N9 v63.41,31.02 | v63.41,31.02 | DRAM.K8 v64.18,28.64 | v64.18,28.64 | DRAM.H9 v63.39,27.04 | v63.39,27.04
  Top 0.203: U1.62 68.56,39.93 68.54,39.93 68.54,39.6 67.34,39.6 67.34,38.82 C20.1 C19.1 64.96,38.82 | C18.1 57.75,43.87 U1.43 | C17.1 57.75,49.07 U1.30 | U1.23 57.75,51.87 C16.1
3.3V  (5 unrouted)
  Top 0.203: U1.97 83.61,46.67 C29.1 | C2.1 82.44,49.91 82.44,47.87 U1.100 | 74.13,41.47 U1.76 74.16,40.31 69.6,40.31 C30.1 | U1.5 57.76,59.07 C1.1 | U1.163 66.96,63.57 C4.1 | U1.142 75.36,64.6 C3.1
DDR_A0  (via drill 0.25 pad 0.36)  (1 unrouted)
  Top 0.127: DRAM.N3 v68.98,31.04 | v68.98,31.04
DDR_A1  (via drill 0.25 pad 0.36)  (1 unrouted)
  Top 0.127: DRAM.P7 v64.98,31.84 | v64.98,31.84
DDR_A2  (via drill 0.25 pad 0.36)  (1 unrouted)
  Top 0.127: DRAM.P3 v68.98,31.84 | v68.98,31.84
DDR_A3  (via drill 0.25 pad 0.36)  (1 unrouted)
  Top 0.127: DRAM.N2 v69.78,31.04 | v69.78,31.04
DDR_A4  (via drill 0.25 pad 0.36)  (1 unrouted)
  Top 0.127: DRAM.P8 | DRAM.P8 v64.18,31.84
DDR_A5  (via drill 0.25 pad 0.36)  (1 unrouted)
  Top 0.127: DRAM.P2 v69.78,31.84 | v69.78,31.84
DDR_A6  (via drill 0.25 pad 0.36)  (1 unrouted)
  Top 0.127: DRAM.R8 v64.18,32.64
DDR_A7  (via drill 0.25 pad 0.36)  (1 unrouted)
  Top 0.127: DRAM.R2 v69.78,32.64 | v69.78,32.64
DDR_A8  (via drill 0.25 pad 0.36)  (1 unrouted)
  Top 0.127: DRAM.T8 | DRAM.T8 v64.18,33.45
DDR_A9  (via drill 0.25 pad 0.36)  (1 unrouted)
  Top 0.127: DRAM.R3 v68.98,32.64 | v68.98,32.64
DDR_A10  (via drill 0.25 pad 0.36)  (1 unrouted)
  Top 0.127: DRAM.L7 v64.98,29.44 | v64.98,29.44
DDR_A11  (via drill 0.25 pad 0.36)  (1 unrouted)
  Top 0.127: DRAM.R7 v64.98,32.64
DDR_A12  (via drill 0.25 pad 0.36)  (1 unrouted)
  Top 0.127: DRAM.N7 v64.98,31.04 | v64.98,31.04
DDR_A13  (via drill 0.25 pad 0.36)  (1 unrouted)
  Top 0.127: DRAM.T3 v69.01,33.48 | v69.01,33.48
DDR_BA0  (via drill 0.25 pad 0.36)  (1 unrouted)
  Top 0.127: DRAM.M2 v69.78,30.24 | v69.78,30.24
DDR_BA1  (via drill 0.25 pad 0.36)  (1 unrouted)
  Top 0.127: DRAM.N8 v64.18,31.04
DDR_BA2  (via drill 0.25 pad 0.36)  (1 unrouted)
  Top 0.127: DRAM.M3 v68.98,30.24 | v68.98,30.24
DDR_CAS  (via drill 0.25 pad 0.36)  (1 unrouted)
  Top 0.127: DRAM.K3 v68.98,28.64
DDR_CK_N  (via drill 0.25 pad 0.36)  (2 unrouted)
  Top 0.127: v64.98,28.64 65.36,28.24 DRAM.K7
DDR_CK_P  (via drill 0.25 pad 0.36)  (2 unrouted)
  Top 0.127: v64.98,27.84 65.37,27.44 DRAM.J7
DDR_CKE  (via drill 0.25 pad 0.36)  (1 unrouted)
  Top 0.127: DRAM.K9 v63.4,28.63 | v63.4,28.63
DDR_D0  (via drill 0.25 pad 0.36)  (1 unrouted)
  Top 0.127: DRAM.E3 v68.98,24.64
DDR_D1  (via drill 0.25 pad 0.36)  (1 unrouted)
  Top 0.127: DRAM.F7 v64.98,25.44
DDR_D2  (via drill 0.25 pad 0.36)  (1 unrouted)
  Top 0.127: DRAM.F2 v69.78,25.44
DDR_D3  (via drill 0.25 pad 0.36)  (1 unrouted)
  Top 0.127: DRAM.F8 v64.2,25.42 | v64.2,25.42
DDR_D4  (via drill 0.25 pad 0.36)  (1 unrouted)
  Top 0.127: DRAM.H3 v68.98,27.04 | v68.98,27.04
DDR_D5  (via drill 0.25 pad 0.36)  (1 unrouted)
  Top 0.127: DRAM.H8 v64.18,27.04
DDR_D6  (via drill 0.25 pad 0.36)  (1 unrouted)
  Top 0.127: DRAM.G2 v69.78,26.24 | v69.78,26.24
DDR_D7  (via drill 0.25 pad 0.36)  (1 unrouted)
  Top 0.127: DRAM.H7 v64.98,27.04
DDR_D8  (via drill 0.25 pad 0.36)  (1 unrouted)
  Top 0.127: DRAM.D7 v65,23.82
DDR_D9  (via drill 0.25 pad 0.36)  (1 unrouted)
  Top 0.127: DRAM.C3 v68.98,23.04 | v68.98,23.04
DDR_D10  (via drill 0.25 pad 0.36)  (1 unrouted)
  Top 0.127: DRAM.C8 v64.18,23.04 | v64.18,23.04
DDR_D11  (via drill 0.25 pad 0.36)  (1 unrouted)
  Top 0.127: DRAM.C2 | DRAM.C2 v69.78,23.04
DDR_D12  (via drill 0.25 pad 0.36)  (1 unrouted)
  Top 0.127: DRAM.A7 v64.98,21.44
DDR_D13  (via drill 0.25 pad 0.36)  (1 unrouted)
  Top 0.127: DRAM.A2 v69.78,21.44
DDR_D14  (via drill 0.25 pad 0.36)  (1 unrouted)
  Top 0.127: DRAM.B8 v64.18,22.24
DDR_D15  (via drill 0.25 pad 0.36)  (1 unrouted)
  Top 0.127: DRAM.A3 v68.98,21.44 | v68.98,21.44
DDR_DM0  (via drill 0.25 pad 0.36)  (1 unrouted)
  Top 0.127: DRAM.E7 v64.98,24.64 | v64.98,24.64
DDR_DM1  (via drill 0.25 pad 0.36)  (1 unrouted)
  Top 0.127: DRAM.D3 v68.98,23.84 | v68.98,23.84
DDR_DQS0_N  (1 unrouted)
DDR_DQS0_P  (1 unrouted)
DDR_DQS1_N  (via drill 0.25 pad 0.36)  (1 unrouted)
  Top 0.127: v64.98,22.24 DRAM.B7 | DRAM.B7
DDR_DQS1_P  (via drill 0.25 pad 0.36)  (1 unrouted)
  Top 0.127: v64.98,23.04 DRAM.C7
DDR_ODT  (via drill 0.25 pad 0.36)  (1 unrouted)
  Top 0.127: DRAM.K1 v70.6,28.66 | v70.6,28.66
DDR_RAS  (via drill 0.25 pad 0.36)  (1 unrouted)
  Top 0.127: DRAM.J3 | DRAM.J3 v68.98,27.84
DDR_RESET  (via drill 0.25 pad 0.36)  (1 unrouted)
  Top 0.127: DRAM.T2 v69.8,33.46 | v69.8,33.46
DDR_VREF  (via drill 0.25 pad 0.36)  (5 unrouted)
  Top 0.127: DRAM.H1 v70.58,27.04 | v70.58,27.04 | DRAM.M8 v64.18,30.24
DDR_WE  (via drill 0.25 pad 0.36)  (1 unrouted)
  Top 0.127: DRAM.L3 v68.98,29.44 | v68.98,29.44
GND  (via drill 0.25 pad 0.36)  (66 unrouted)
  Top 0.127: DRAM.B3 v68.98,22.24 | v68.98,22.24 | DRAM.B1 v70.59,22.25 | v70.59,22.25 | DRAM.E2 69.59,24.24 69.61,24.26 69.96,24.26 69.97,24.24 DRAM.E1 | DRAM.E1 70.18,24.04 70.2,24.02 70.2,23.67 70.18,23.65 DRAM.D1 70.18,23.24 70.58,22.84 v70.58,22.25 v70.59,22.25 | DRAM.J2 v69.78,27.84 | v69.78,27.84 | DRAM.L2 v69.79,29.45 | v69.79,29.45 | v69.79,29.45 DRAM.M1 70.96,30.62 70.96,31.18 70.72,31.42 | v69.79,29.45 | DRAM.E1 70.18,24.45 71.01,25.28 71.01,25.62 70.76,25.87 70.41,25.87 70.39,25.84 DRAM.G1 | DRAM.P1 70.2,31.42 70.72,31.42 | DRAM.T1 70.39,33.04 70.42,33.08 70.77,33.08 71.01,32.83 71.01,32.48 70.72,32.19 70.72,31.42 | v64.19,24.64 DRAM.E8 DRAM.D8 | v64.19,24.64 | v64.19,24.64 DRAM.F9 DRAM.G9 DRAM.G8 | v63.39,22.24 DRAM.B9 63.78,21.64 63.76,21.62 63.76,21.27 63.78,21.25 DRAM.A9 | v63.39,22.24 | DRAM.J8 v64.18,27.84 | v64.18,27.84 | DRAM.P9 v63.4,31.83 | v63.4,31.83 | DRAM.M9 v63.4,30.23
N$1
  Top 0.152: 83.61,43.38 Y1.3
  Top 0.203: U1.92 83.57,44.67 | 83.57,44.67 Y1.3 | 83.57,44.67 83.57,45.34 C32.1
N$2
  Top 0.152: C31.1 85.47,37.72 | 85.47,39.68 Y1.1
  Top 0.203: C31.1 85.6,37.72 85.6,39.68 Y1.1 | Y1.1 85.86,42.04 82.75,42.04 82.75,44.27 U1.91
N$12
  Top 0.203: U1.83 76.96,39.6 80.26,39.6 C13.1
N$13
  Top 0.203: C14.1 76.56,38.82 | 76.56,38.82 C15.1 R1.2 | U1.82 76.56,38.82
N$24
  Top 0.203: C26.1 74.17,39.65 74.82,39.65 74.82,40.31 76.16,40.31 U1.81
N$25
  Top 0.203: C27.1 C28.1 72.64,39.98 74.49,39.98 74.49,40.64 75.76,40.64 U1.80
ZQ  (via drill 0.25 pad 0.36)  (1 unrouted)
  Top 0.127: DRAM.L8 v64.18,29.44

### Text on the board
tNames: FeverDream